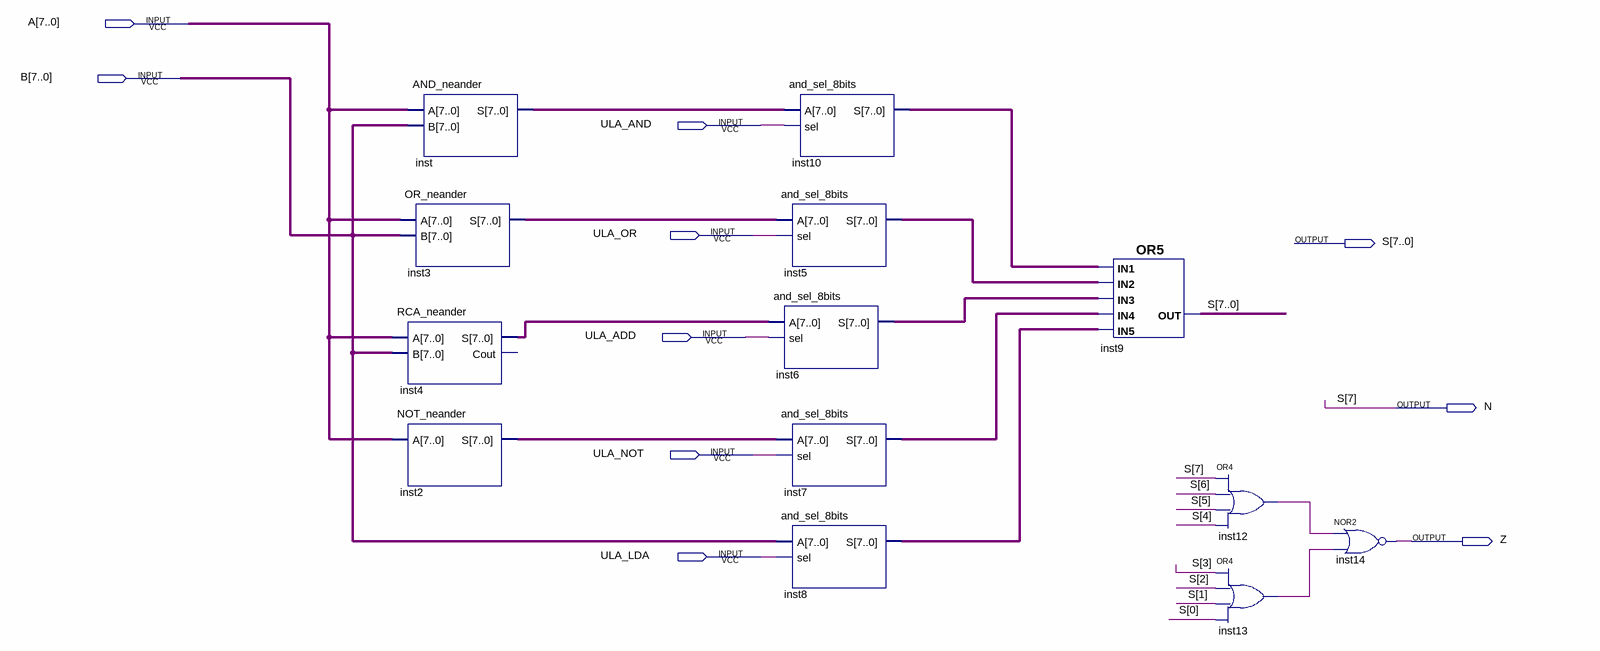
[diagram p0: schematic sheet]
// Quartus schematic ULA_neander.bdf as structural Verilog: 13 symbols, 10 pins
module ULA_neander (
  input  [7:0] A,
  input  [7:0] B,
  input  ULA_AND,
  input  ULA_OR,
  input  ULA_ADD,
  input  ULA_NOT,
  input  ULA_LDA,
  output [7:0] S,
  output N,
  output Z
);

  wire inst12_out, inst13_out;
  wire [7:0] inst2_s, inst3_s, inst4_s, inst5_s, inst6_s, inst7_s, inst8_s, inst10_s, inst_s;

  AND_neander inst (.A(A), .B(B), .S(inst_s));
  OR_neander inst3 (.A(A), .B(B), .S(inst3_s));
  RCA_neander inst4 (.A(A), .B(B), .S(inst4_s));  // open: Cout
  NOT_neander inst2 (.A(A), .S(inst2_s));
  and_sel_8bits inst10 (.A(inst_s), .sel(ULA_AND), .S(inst10_s));
  and_sel_8bits inst5 (.A(inst3_s), .sel(ULA_OR), .S(inst5_s));
  and_sel_8bits inst6 (.A(inst4_s), .sel(ULA_ADD), .S(inst6_s));
  and_sel_8bits inst7 (.A(inst2_s), .sel(ULA_NOT), .S(inst7_s));
  and_sel_8bits inst8 (.A(B), .sel(ULA_LDA), .S(inst8_s));
  assign {N, S[6:0]} = inst10_s | inst5_s | inst6_s | inst7_s | inst8_s;  // OR5 inst9, 8 bits wide
  or inst12 (inst12_out, N, S[6], S[5], S[4]);
  or inst13 (inst13_out, S[3], S[2], S[1], S[0]);
  nor inst14 (Z, inst12_out, inst13_out);

  assign S[7] = N;
endmodule
